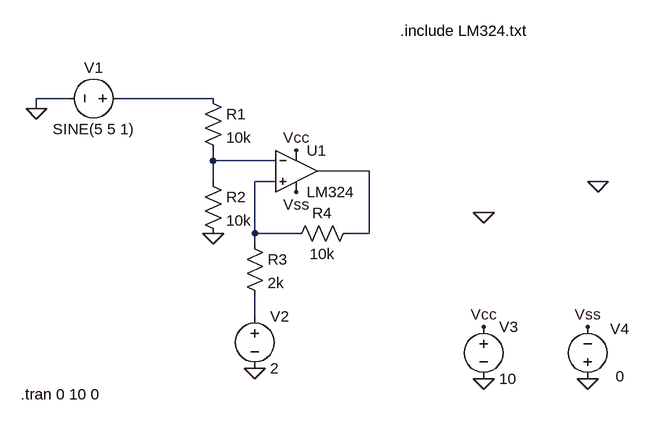
[diagram p0: schematic Circuito_4.asc]
Circuito_4.asc, the LTspice schematic file:
Version 4
SHEET 1 1156 680
WIRE -160 64 -208 64
WIRE 64 64 -80 64
WIRE -208 80 -208 64
WIRE 64 160 64 144
WIRE 160 160 64 160
WIRE 304 176 224 176
WIRE 64 192 64 160
WIRE 160 192 128 192
WIRE 128 272 128 192
WIRE 192 272 128 272
WIRE 304 272 304 176
WIRE 304 272 272 272
WIRE 128 288 128 272
WIRE 128 400 128 368
FLAG 64 272 0
FLAG -208 80 0
FLAG 128 480 0
FLAG 480 496 0
FLAG 640 496 0
FLAG 640 416 Vss
FLAG 480 416 Vcc
FLAG 192 144 Vcc
FLAG 192 208 Vss
FLAG 480 240 0
FLAG 656 192 0
SYMBOL OpAmps\\opamp2 192 112 R0
SYMATTR InstName U1
SYMATTR Value LM324
SYMBOL res 48 48 R0
SYMATTR InstName R1
SYMATTR Value 10k
SYMBOL res 48 176 R0
SYMATTR InstName R2
SYMATTR Value 10k
SYMBOL res 112 272 R0
SYMATTR InstName R3
SYMATTR Value 2k
SYMBOL res 288 256 R90
WINDOW 0 0 56 VBottom 2
WINDOW 3 32 56 VTop 2
SYMATTR InstName R4
SYMATTR Value 10k
SYMBOL voltage -64 64 R90
WINDOW 0 -32 56 VBottom 2
WINDOW 3 32 56 VTop 2
WINDOW 123 0 0 Left 0
WINDOW 39 0 0 Left 0
SYMATTR InstName V1
SYMATTR Value SINE(5 5 1)
SYMBOL voltage 128 384 R0
WINDOW 123 0 0 Left 0
WINDOW 39 0 0 Left 0
SYMATTR InstName V2
SYMATTR Value 2
SYMBOL voltage 480 400 R0
WINDOW 123 0 0 Left 0
WINDOW 39 0 0 Left 0
SYMATTR InstName V3
SYMATTR Value 10
SYMBOL voltage 640 512 R180
WINDOW 0 -64 93 Left 2
WINDOW 3 -57 20 Left 2
WINDOW 123 0 0 Left 0
WINDOW 39 0 0 Left 0
SYMATTR InstName V4
SYMATTR Value 0
TEXT -232 520 Left 2 !.tran 0 10 0
TEXT 352 -40 Left 2 !.include LM324.txt

The netlist it stands for:
* Circuito_4.asc
XU1 N004 N002 Vcc Vss N003 LM324  ; pins In+ In- V+ V- OUT
R1 N001 N002 10k
R2 N002 0 10k
R3 N004 N005 2k
R4 N003 N004 10k
V1 N001 0 SINE(5 5 1)
V2 N005 0 2
V3 Vcc 0 10
V4 0 Vss 0
.tran 0 10 0
.include LM324.txt
.backanno
.end